# EAGLE design Altimeter (EAGLE 8.4.0)
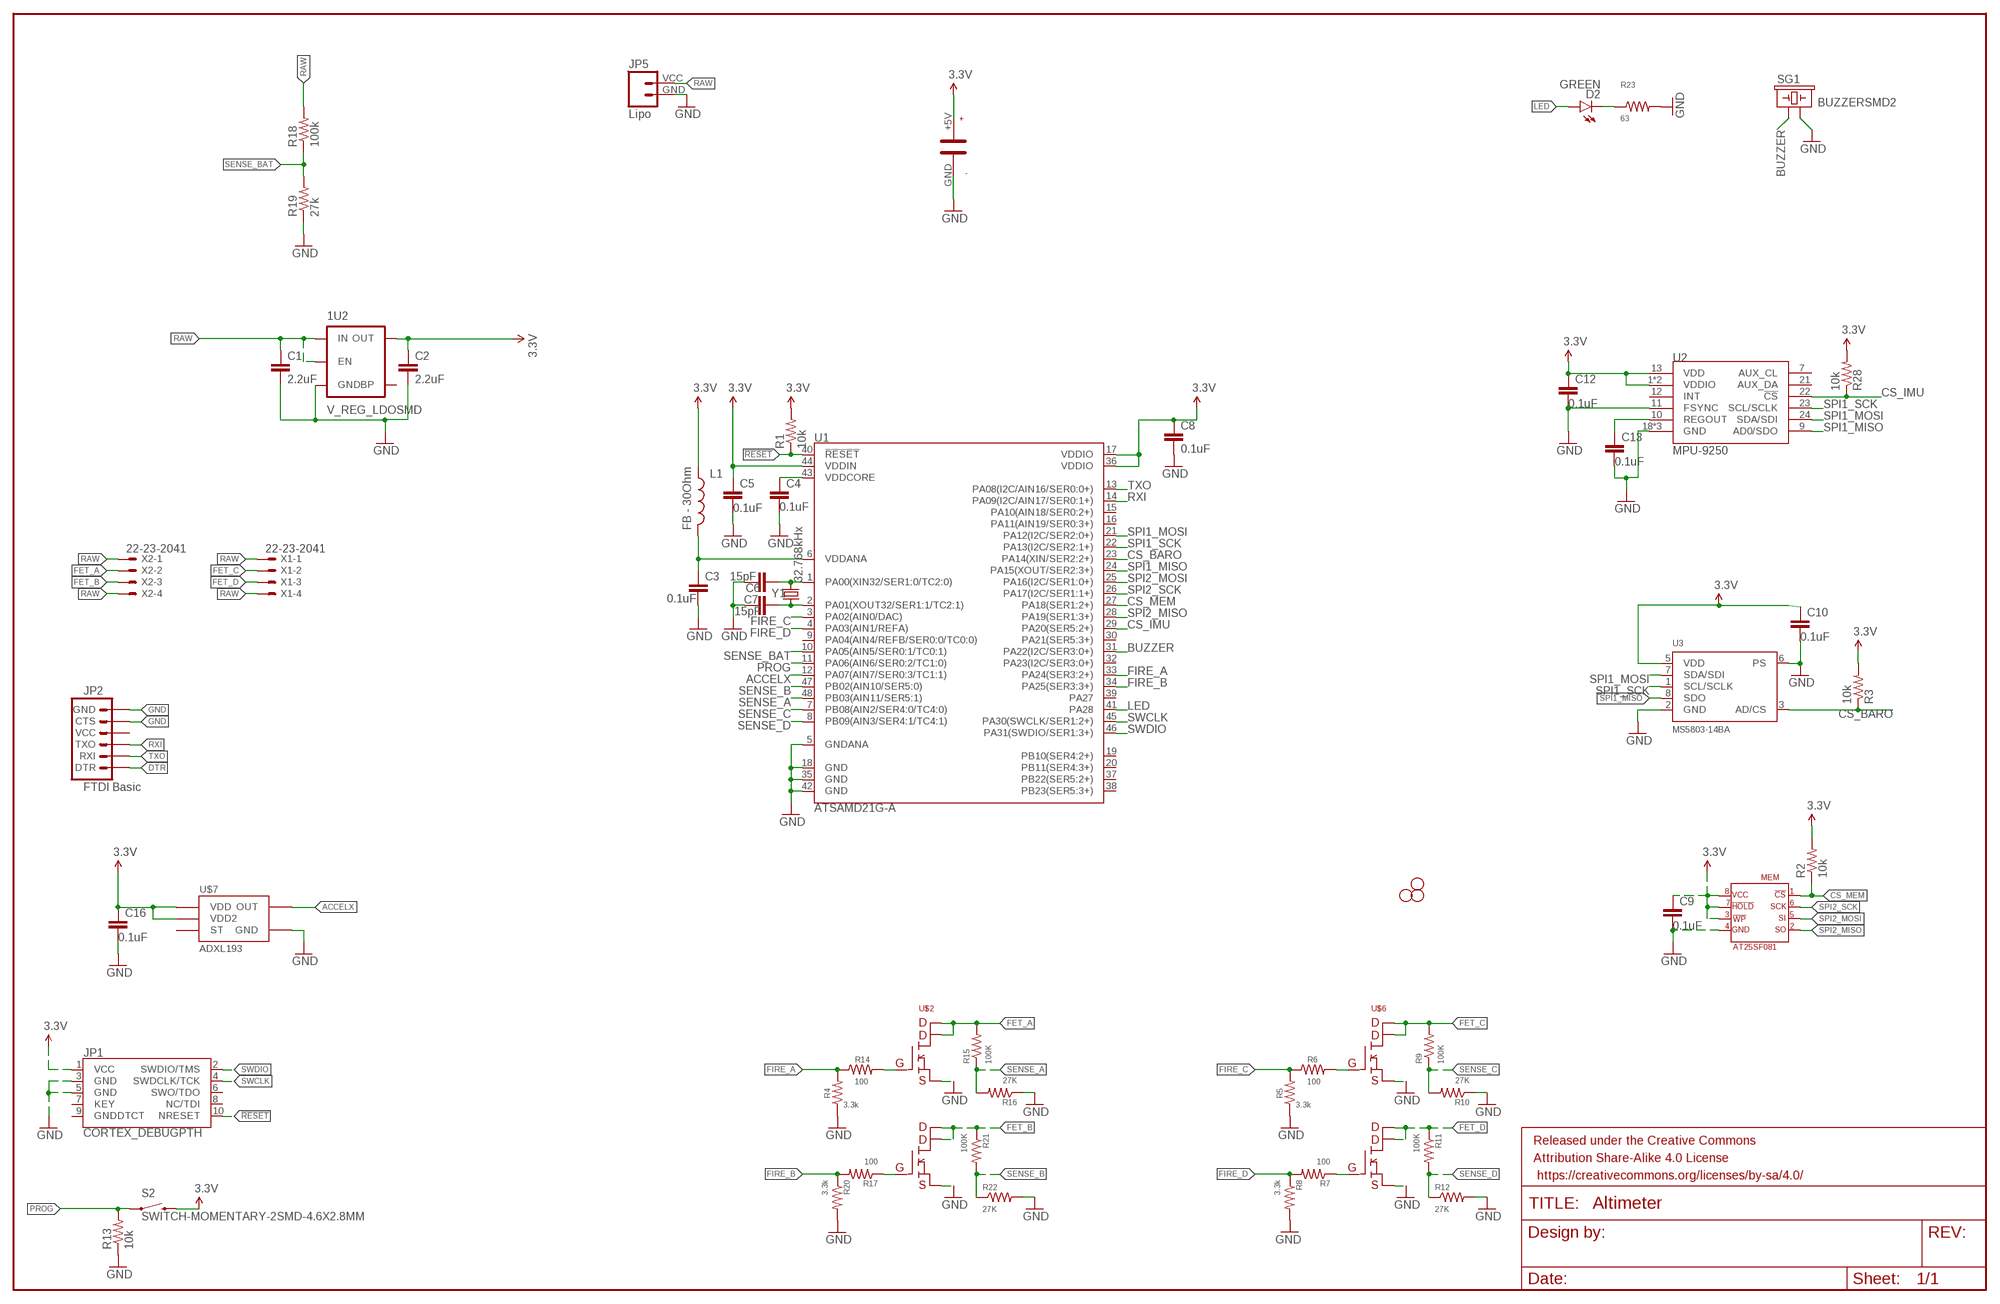
[diagram p0: schematic, sheet 1]

## Parts
1U2  V_REG_LDOSMD  [SOT23-5]
C1  2.2uF  CAP0603-CAP  [0603-CAP]
C2  2.2uF  CAP0603-CAP  [0603-CAP]
C3  0.1uF  CAP0402-CAP  [0402-CAP]
C4  0.1uF  CAP0402-CAP  [0402-CAP]
C5  0.1uF  CAP0402-CAP  [0402-CAP]
C6  15pF  CAP0402-CAP  [0402-CAP]
C7  15pF  CAP0402-CAP  [0402-CAP]
C8  0.1uF  CAP0402-CAP  [0402-CAP]
C9  0.1uF  CAP0402-CAP  [0402-CAP]
C10  0.1uF  CAP0402-CAP  [0402-CAP]
C12  0.1uF  CAP0402-CAP  [0402-CAP]
C13  0.1uF  CAP0402-CAP  [0402-CAP]
C16  0.1uF  CAP0402-CAP  [0402-CAP]
D2  GREEN  LED-GREEN1206  [LED-1206]
FRAME1  FRAME-LEDGER  [CREATIVE_COMMONS]
JP1  CORTEX_DEBUGPTH  [2X5-PTH-1.27MM]
JP2  FTDI Basic  ARDUINO_SERIAL_PROGRAMPTH  [1X06]
JP5  Lipo  M024UCON-15767  [JST-2-SMD-VERT]
L1  FB - 30Ohm  INDUCTOR0603  [0603]
MEM  AT25SF081  [AT25SF081]
R1  10k  RESISTOR0402-RES  [0402-RES]
R2  10k  RESISTOR0402-RES  [0402-RES]
R3  10k  RESISTOR0402-RES  [0402-RES]
R4  3.3k  RESISTOR0402  [0402-RES]
R5  3.3k  RESISTOR0402  [0402-RES]
R6  100  RESISTOR0402  [0402-RES]
R7  100  RESISTOR0402  [0402-RES]
R8  3.3k  RESISTOR0402  [0402-RES]
R9  100K  RESISTOR0402  [0402-RES]
R10  27K  RESISTOR0402  [0402-RES]
R11  100K  RESISTOR0402  [0402-RES]
R12  27K  RESISTOR0402  [0402-RES]
R13  10k  RESISTOR0402-RES  [0402-RES]
R14  100  RESISTOR0402  [0402-RES]
R15  100K  RESISTOR0402  [0402-RES]
R16  27K  RESISTOR0402  [0402-RES]
R17  100  RESISTOR0402  [0402-RES]
R18  100k  RESISTOR0402-RES  [0402-RES]
R19  27k  RESISTOR0402-RES  [0402-RES]
R20  3.3k  RESISTOR0402  [0402-RES]
R21  100K  RESISTOR0402  [0402-RES]
R22  27K  RESISTOR0402  [0402-RES]
R23  63  RESISTOR0402  [0402-RES]
R28  10k  RESISTOR0402-RES  [0402-RES]
S2  SWITCH-MOMENTARY-2SMD-4.6X2.8MM  [TACTILE_SWITCH_SMD_4.6X2.8MM]
SG1  BUZZERSMD2  [BUZZER-CCV]
STANDOFF2  STAND-OFF  [STAND-OFF]
STANDOFF3  STAND-OFF  [STAND-OFF]
STANDOFF4  STAND-OFF  [STAND-OFF]
U1  ATSAMD21G-A  [TQFP-48]
U2  MPU-9250  [QFN24_PAD]
U3  MS5803-14BA  [MS5803]
U$1  PB-5R0H104-R  [PB-5R0H104-R]
U$2  SI7232DN  [SI7232DN]
U$6  SI7232DN  [SI7232DN]
U$7  ADXL193  [ADXL193]
X1  22-23-2041  [22-23-2041]
X2  22-23-2041  [22-23-2041]
Y1  32.768kHx  CRYSTAL3.2X1.5MM  [CRYSTAL-SMD-3.2X1.5MM]

## Nets
3.3V: 1U2.5(OUT) C2.1 C5.1 C8.1 C9.1 C10.1 C12.1 C16.1 JP1.1(VCC) L1.1 MEM.!HOLD MEM.!WP MEM.VCC R1.2 R2.2 R3.2 R28.2 S2.3 S2.4 U1.17(VDDIO) U1.36(VDDIO) U1.44(VDDIN) U2.1(VDDIO) U2.8(VDDIO) U2.13(VDD) U3.5(VDD) U$1.+5V U$7.P$7(VDD) U$7.P$8(VDD2)
!RESET: JP1.10(NRESET) R1.1 U1.40(!RESET!)
ACCELX: U1.12(PA07(AIN7/SER0:3/TC1:1)) U$7.P$6(OUT)
BUZZER: SG1.+ U1.31(PA22(I2C/SER3:0+))
CS_BARO: R3.1 U1.23(PA14(XIN/SER2:2+)) U3.3(AD/CS)
CS_IMU: R28.1 U1.29(PA20(SER5:2+)) U2.22(!CS)
CS_MEM: MEM.!CS R2.1 U1.27(PA18(SER1:2+))
DTR: JP2.1(DTR)
FET_A: R15.2 U$2.7(PIN7) U$2.8(PIN8) X2.2
FET_B: R21.1 U$2.5(PIN5) U$2.6(PIN6) X2.3
FET_C: R9.2 U$6.7(PIN7) U$6.8(PIN8) X1.2
FET_D: R11.1 U$6.5(PIN5) U$6.6(PIN6) X1.3
FIRE_A: R4.2 R14.1 U1.33(PA24(SER3:2+))
FIRE_B: R17.2 R20.1 U1.34(PA25(SER3:3+))
FIRE_C: R5.2 R6.1 U1.3(PA02(AIN0/DAC))
FIRE_D: R7.2 R8.1 U1.4(PA03(AIN1/REFA))
GND: 1U2.2(GND) C1.2 C2.2 C3.2 C4.2 C5.2 C6.2 C7.2 C8.2 C9.2 C10.2 C12.2 C13.2 C16.2 JP1.3(GND) JP1.5(GND) JP2.5(CTS) JP2.6(GND) JP5.GND MEM.GND R4.1 R5.1 R8.2 R10.1 R12.2 R13.1 R16.1 R19.1 R20.2 R22.2 R23.2 SG1.- U1.5(GNDANA) U1.18(GND) U1.35(GND) U1.42(GND) U2.11(FSYNC) U2.18(GND) U2.20(GND) U2.CENTER(GND) U3.2(GND) U3.6(PS) U$1.GND U$2.1(PIN1) U$2.3(PIN3) U$6.1(PIN1) U$6.3(PIN3) U$7.P$3(GND)
LED: D2.A U1.41(PA28)
N$1: R6.2 U$6.2(PIN2)
N$3: C6.1 U1.1(PA00(XIN32/SER1:0/TC2:0)) Y1.P$2
N$4: C7.1 U1.2(PA01(XOUT32/SER1:1/TC2:1)) Y1.P$1
N$5: C3.1 L1.2 U1.6(VDDANA)
N$6: C4.1 U1.43(VDDCORE)
N$8: R7.1 U$6.4(PIN4)
N$12: R14.2 U$2.2(PIN2)
N$13: R17.1 U$2.4(PIN4)
N$29: D2.C R23.1
PROG: R13.2 S2.1 S2.2 U1.11(PA06(AIN6/SER0:2/TC1:0))
RAW: 1U2.1(IN) 1U2.3(EN) C1.1 JP5.VCC R18.2 X1.1 X1.4 X2.1 X2.4
REGOUT: C13.1 U2.10(REGOUT)
RXI: JP2.3(TXO) U1.14(PA09(I2C/AIN17/SER0:1+))
SENSE_A: R15.1 R16.2 U1.48(PB03(AIN11/SER5:1))
SENSE_B: R21.2 R22.1 U1.47(PB02(AIN10/SER5:0))
SENSE_BAT: R18.1 R19.2 U1.10(PA05(AIN5/SER0:1/TC0:1))
SENSE_C: R9.1 R10.2 U1.7(PB08(AIN2/SER4:0/TC4:0))
SENSE_D: R11.2 R12.1 U1.8(PB09(AIN3/SER4:1/TC4:1))
SPI1_MISO: U1.24(PA15(XOUT/SER2:3+)) U2.9(AD0/SDO) U3.8(SDO)
SPI1_MOSI: U1.21(PA12(I2C/SER2:0+)) U2.24(SDA/SDI) U3.7(SDA/SDI)
SPI1_SCK: U1.22(PA13(I2C/SER2:1+)) U2.23(SCL/SCLK) U3.1(SCL/SCLK)
SPI2_MISO: MEM.SO U1.28(PA19(SER1:3+))
SPI2_MOSI: MEM.SI U1.25(PA16(I2C/SER1:0+))
SPI2_SCK: MEM.SCK U1.26(PA17(I2C/SER1:1+))
SWCLK: JP1.4(SWDCLK/TCK) U1.45(PA30(SWCLK/SER1:2+))
SWDIO: JP1.2(SWDIO/TMS) U1.46(PA31(SWDIO/SER1:3+))
TXO: JP2.2(RXI) U1.13(PA08(I2C/AIN16/SER0:0+))
Unconnected: 1U2.4(BP) JP1.6(SWO/TDO) JP1.7(KEY) JP1.8(NC/TDI) JP1.9(GNDDTCT) JP2.4(VCC) U1.9(PA04(AIN4/REFB/SER0:0/TC0:0)) U1.15(PA10(AIN18/SER0:2+)) U1.16(PA11(AIN19/SER0:3+)) U1.19(PB10(SER4:2+)) U1.20(PB11(SER4:3+)) U1.30(PA21(SER5:3+)) U1.32(PA23(I2C/SER3:0+)) U1.37(PB22(SER5:2+)) U1.38(PB23(SER5:3+)) U1.39(PA27) U2.7(AUX_CL) U2.12(INT) U2.21(AUX_DA) U$7.P$4(ST)

## Library data of the parts
1U2 = SparkFun-PowerIC:V_REG_LDO: Voltage Regulator LDO Standard 150mA LDO voltage regulator in SOT-23 layout. Micrel part MIC5205. BP (by-pass) pin is used to lower output noise with 470pF cap.
C1 C2 = SparkFun-Capacitors:CAP: Capacitor Standard 0603 ceramic capacitor, and 0.1" leaded capacitor.
C3-C10 C12 C13 C16 = SparkFun-Passives:CAP: Capacitor Standard 0603 ceramic capacitor, and 0.1" leaded capacitor.
D2 = SparkFun-LED:LED-GREEN: Various green LEDs Green LEDs used in SFE Production 0603- DIO-00821 LARGE- DIO-00862 LILYPAD- DIO-09910; PROD_ID: DIO-00862
FRAME1 = SparkFun-Aesthetics:FRAME-LEDGER: Schematic Frame Standard 11x14 US Ledger frame
JP1 = SparkFun-Connectors:CORTEX_DEBUG: Cortex Debug Connector Datasheet <http://infocenter.arm.com/help/topic/com.arm.doc.faqs/attached/13634/cortex_debug_connectors.pdf>
JP2 = SparkFun:ARDUINO_SERIAL_PROGRAM
JP5 = SparkFun-Connectors:M02: Standard 2-pin 0.1" header. Use with - straight break away headers ( PRT-00116) - right angle break away headers (PRT-00553) - swiss pins (PRT-00743) - machine pins (PRT-00117) - female headers (PRT-00115) Molex polarized connector foot print use with: PRT-08233 with associated crimp pins and housings. 2.54_SCREWTERM for use with PRT-10571. 3.5mm Screw Terminal footprints for PRT-08084 5mm Screw Terminal footprints for use with PRT-08432
L1 = SparkFun-Passives:INDUCTOR: Inductors Basic Inductor/Choke - 0603 and 1206. Footprints are not proven and vary greatly between part numbers. INDUCTOR POWER 3.3UH 4.0A SMD 0.197" L x 0.197" W x 0.177" H (5.00mm x 5.00mm x 4.50mm)
MEM = SaL-lib:AT25SF081: AT25SF081 - 8M memory smd
R1-R3 R13 R18 R19 R28 = SparkFun-Passives:RESISTOR: Resistor Basic schematic elements and footprints for 0603, 1206, and PTH resistors.
R4-R12 R14-R17 R20-R23 = SparkFun-Resistors:RESISTOR: Resistor Basic schematic elements and footprints for 0603, 1206, and PTH resistors.
S2 = SparkFun-Electromechanical:SWITCH-MOMENTARY-2: Various NO switches- pushbuttons, reed, etc; PROD_ID: SWCH-13065
SG1 = SparkFun-Electromechanical:BUZZER: Buzzer 12mm Spark Fun Electronics SKU : Comp-Buzzer
STANDOFF2-STANDOFF4 = SparkFun-Electromechanical:STAND-OFF: #4 Stand Off This is the mechanical footprint for a #4 phillips button head screw. Use the keepout ring to avoid running the screw head into surrounding components. SKU : PRT-00447
U1 = SparkFun-DigitalIC:ATSAMD21G: Atmel SAMD21G SMART ARM-Based Microcontroller The Atmel ® | SMART ™ SAM D21 is a series of low-power microcontrollers using the 32-bit ARM ® Cortex ® -M0+ processor, and ranging from 32- to 64-pins with up to 256KB Flash and 32KB of SRAM. The SAM D21 devices operate at a maximum frequency of 48MHz and reach 2.46 CoreMark/MHz. They are designed for simple and intuitive migration with identical peripheral modules, hex compatible code, identical linear address map and pin compatible migration paths between all devices in the product series. All devices include intelligent and flexible peripherals, Atmel Event System for inter-peripheral signaling, and support for capacitive touch button, slider and wheel user interfaces.; PROD_ID: IC-13064
U2 = Testing:MPU-9250: NC pin 19. 2-6 & 14-17 not internally connected. May be used for PCB trace routing.; PROD_ID: IC-13192
U3 = MS5803:MS5803-14BA; PROD_ID: IC-12111
U$1 = SaL-lib1:PB-5R0H104-R
U$2 U$6 = SaL-lib:SI7232DN: SI7232DN dual
U$7 = SparkFun-Sensors:ADXL193: 250g accelerometer analog out
X1 X2 = con-molex:22-23-2041: .100" (2.54mm) Center Header - 4 Pin; MF: MOLEX; MPN: 22-23-2041; OC_FARNELL: 1462920; OC_NEWARK: 38C0355
Y1 = SparkFun-FreqCtrl:CRYSTAL: Various standard crystals. Proven footprints.

## Net classes
1 vcc: width 0.254 mm

## Board
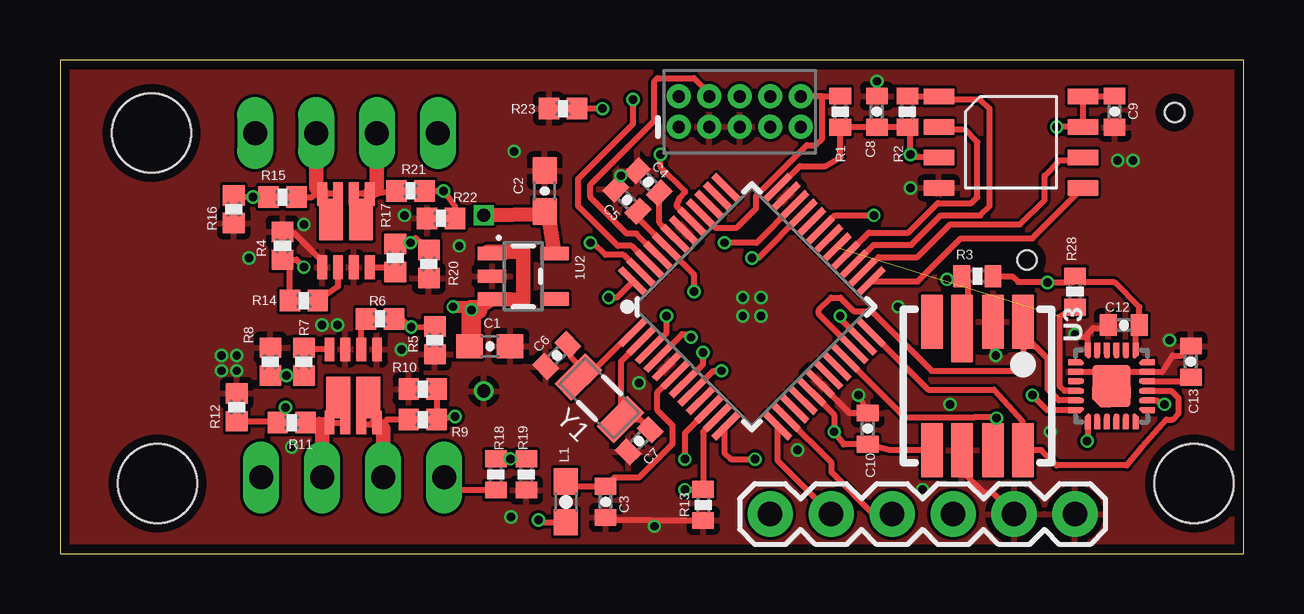
[diagram p1: board, top side]
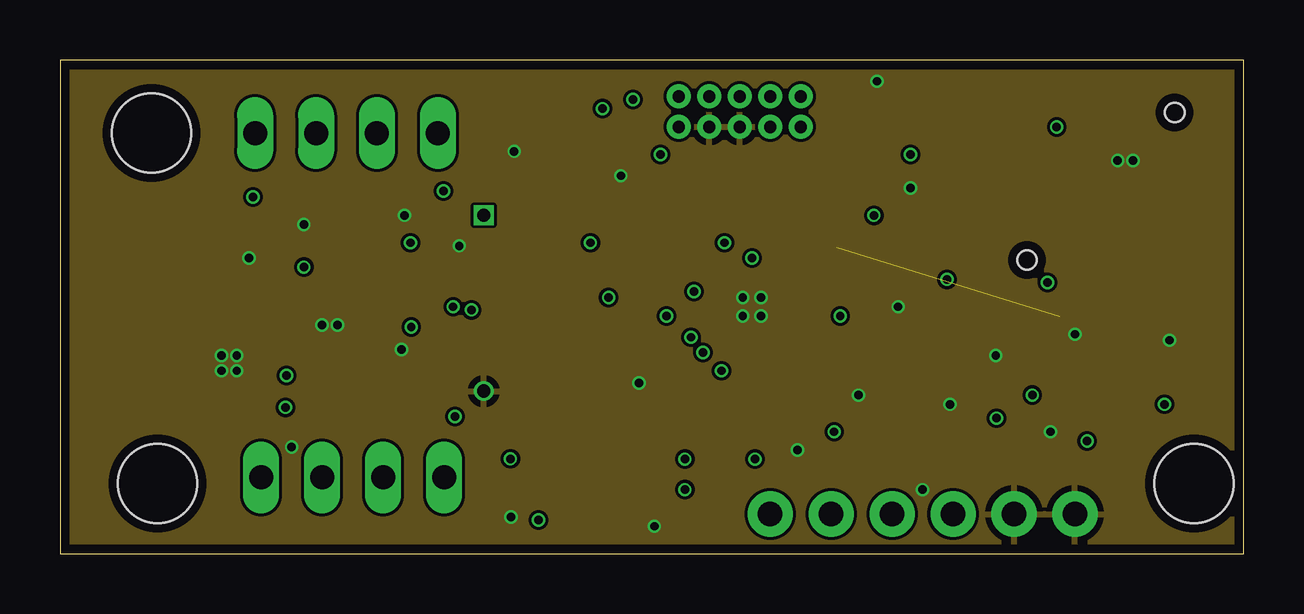
[diagram p2: board, inner layer Route2]
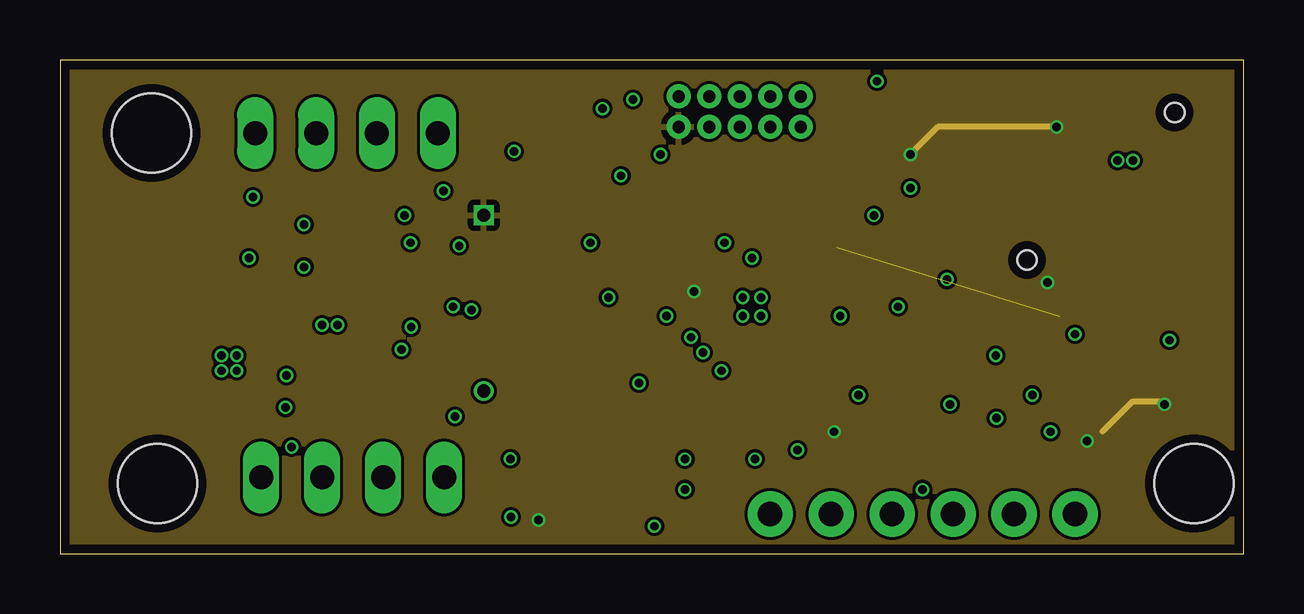
[diagram p3: board, inner layer Route15]
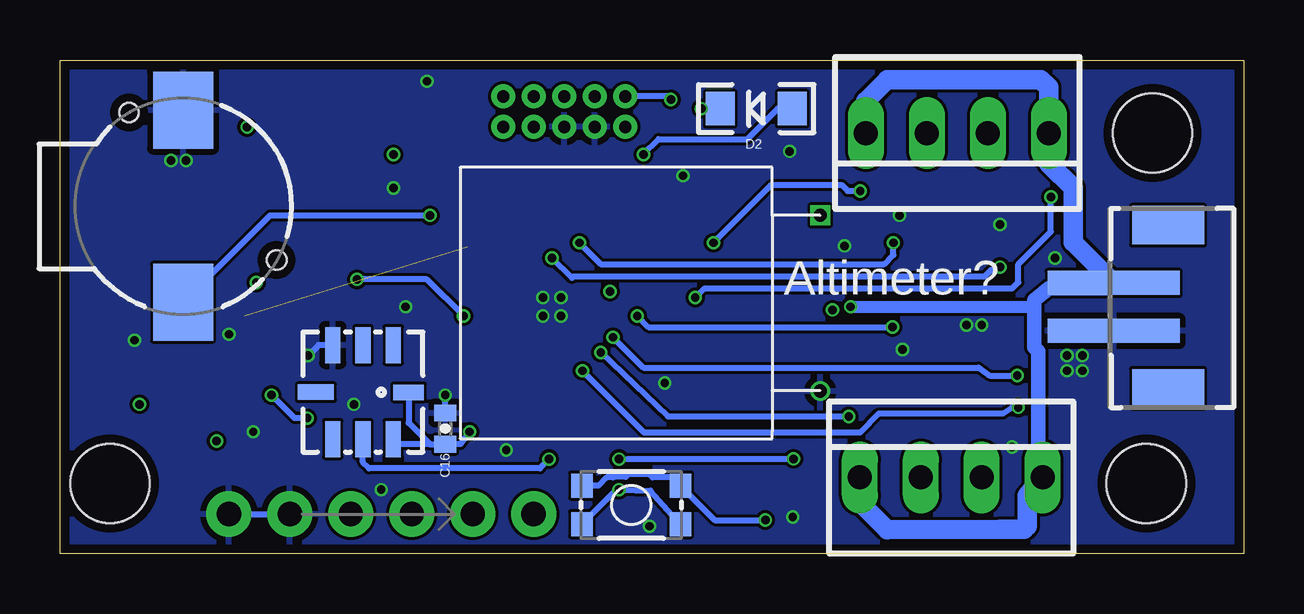
[diagram p4: board, bottom side, seen from below]

Size 49.33 x 20.56 mm. Coordinates in mm from the lower left corner, seen from the top.
Outline: 0,0 49.33,0 49.33,20.56 0,20.56 0,0
Copper layers (1*2*15*16): Top 0.035559375mm / dielectric 0.17018125mm / Route2 0.01778125mm / dielectric 47mil / Route15 0.01778125mm / dielectric 0.17018125mm / Bottom 0.035559375mm
Design rules "oshpark-4layer-tented": minimum track width 5mil, minimum drill 10mil, track to track 5mil, track to pad 5mil, pad to pad 5mil, via to via 5mil, smd to smd 5mil, copper to edge 15mil, drill to drill 6mil, minimum pad ring 4mil, minimum via ring 4mil, stop-mask expansion 2.5mil, vias tented up to drill 20mil, thermal gap 10mil

### Footprints (pad centres in the part's own frame; a part is rotated, then mirrored left to right if it is on the bottom)
SOT23-5 = smd 0.55 x 1.2: 1 -0.95,-1.3; 2 0,-1.3; 3 0.95,-1.3; 4 0.95,1.3; 5 -0.95,1.3
0603-CAP = smd 1.1 x 1: 1 -0.85,0; 2 0.85,0
0402-CAP = smd 0.7 x 0.9: 1 -0.65,0; 2 0.65,0
LED-1206 = smd 1.2 x 1.4: A -1.5,0; C 1.5,0
2X5-PTH-1.27MM = drill 0.508 pad 1: 1 -2.54,-0.635; 2 -2.54,0.635; 3 -1.27,-0.635; 4 -1.27,0.635; 5 0,-0.635; 6 0,0.635; 7 1.27,-0.635; 8 1.27,0.635; 9 2.54,-0.635; 10 2.54,0.635
1X06 = drill 1.016 pad 1.88: 1 0,0; 2 2.54,0; 3 5.08,0; 4 7.62,0; 5 10.16,0; 6 12.7,0
JST-2-SMD-VERT = smd 1 x 5.5: GND 1,-2; VCC -1,-2 | smd 1.6 x 3: P$1 -3.4,0.27; P$2 3.4,0.27
0603 = smd 1.1 x 1: 1 -0.85,0; 2 0.85,0
AT25SF081 = smd 1.27 x 0.635: !CS -3,2.54; !HOLD 3,1.27; !WP -3,0; GND -3,-1.27; SCK 3,0; SI 3,-1.27; SO -3,1.27; VCC 3,2.54
0402-RES = smd 0.7 x 0.9: 1 -0.65,0; 2 0.65,0
0402-RES' = smd 0.85 x 0.9: 1 -0.58,0; 2 0.58,0
TACTILE_SWITCH_SMD_4.6X2.8MM = smd 0.9 x 1: 1 -2.05,-0.8; 2 2.05,-0.8; 3 2.05,0.8; 4 -2.05,0.8
BUZZER-CCV = smd 3.2 x 2.5: + 4,0; - -4,0 | hole 0.8: -3.9,-2.25; 2.25,3.9
STAND-OFF = hole 3.302: 0,0
TQFP-48 = smd 1.5 x 0.28: 1 -4.25,2.75; 2 -4.25,2.25; 3 -4.25,1.75; 4 -4.25,1.25; 5 -4.25,0.75; 6 -4.25,0.25; 7 -4.25,-0.25; 8 -4.25,-0.75; 9 -4.25,-1.25; 10 -4.25,-1.75; 11 -4.25,-2.25; 12 -4.25,-2.75; 25 4.25,-2.75; 26 4.25,-2.25; 27 4.25,-1.75; 28 4.25,-1.25; 29 4.25,-0.75; 30 4.25,-0.25; 31 4.25,0.25; 32 4.25,0.75; 33 4.25,1.25; 34 4.25,1.75; 35 4.25,2.25; 36 4.25,2.75 | smd 0.28 x 1.5: 13 -2.75,-4.25; 14 -2.25,-4.25; 15 -1.75,-4.25; 16 -1.25,-4.25; 17 -0.75,-4.25; 18 -0.25,-4.25; 19 0.25,-4.25; 20 0.75,-4.25; 21 1.25,-4.25; 22 1.75,-4.25; 23 2.25,-4.25; 24 2.75,-4.25; 37 2.75,4.25; 38 2.25,4.25; 39 1.75,4.25; 40 1.25,4.25; 41 0.75,4.25; 42 0.25,4.25; 43 -0.25,4.25; 44 -0.75,4.25; 45 -1.25,4.25; 46 -1.75,4.25; 47 -2.25,4.25; 48 -2.75,4.25
QFN24_PAD = smd 0.5 x 0.25: 1 -1.55,1; 2 -1.55,0.6; 3 -1.55,0.2; 4 -1.55,-0.2; 5 -1.55,-0.6; 6 -1.55,-1; 13 1.55,-1; 14 1.55,-0.6; 15 1.55,-0.2; 16 1.55,0.2; 17 1.55,0.6; 18 1.55,1 | smd 0.08 x 0.13: 1$1 -1.32,1.06; 1$3 -1.26,0.94; P$33 1.26,-0.94; P$34 1.32,-1.06; P$58 1.26,0.94; P$59 1.32,1.06; P$68 -1.26,-0.94; P$69 -1.32,-1.06 | smd 0.1 x 0.185 rotated 45: 1$2 -1.25,1.024; P$49 1.024,-1.25 | smd 0.14 x 0.14: 1$4 -1.22,0.945; P$23 -0.945,-1.22; P$24 1.22,-0.945; P$36 0.945,1.22; P$51 0.945,-1.22; P$56 1.22,0.945; P$61 -0.945,1.22; P$66 -1.22,-0.945 | smd 0.05 x 0.05: 1$5 -1.175,0.97; P$25 -0.97,-1.175; P$31 1.175,-0.97; P$37 0.97,1.175; P$52 0.97,-1.175; P$57 1.175,0.97; P$62 -0.97,1.175; P$67 -1.175,-0.97 | smd 0.25 x 0.5: 7 -1,-1.55; 8 -0.6,-1.55; 9 -0.2,-1.55; 10 0.2,-1.55; 11 0.6,-1.55; 12 1,-1.55; 19 1,1.55; 20 0.6,1.55; 21 0.2,1.55; 22 -0.2,1.55; 23 -0.6,1.55; 24 -1,1.55 | smd 0.25 x 0.25: CENTER 0,0 | smd 0.4 x 0.4: DBBADFE -0.675,0.24 | smd 0.6 x 1.2: DBBADFE1 -0.575,-0.195 | smd 0.25 x 0.3: P$1 -0.2,1.3; P$3 0.2,1.3; P$5 0.6,1.3; P$11 -0.6,1.3; P$16 0.2,-1.3; P$18 -0.2,-1.3; P$20 -0.6,-1.3; P$26 0.6,-1.3 | smd 0.3 x 0.25: P$2 -1.3,0.2; P$4 -1.3,0.6; P$28 -1.3,-0.2; P$38 -1.3,-0.6; P$40 1.3,0.2; P$42 1.3,-0.2; P$44 1.3,-0.6; P$50 1.3,0.6 | smd 0.1 x 0.185 rotated 225: P$7 1.25,-1.024; P$60 -1.024,1.25 | smd 1.1 x 1.59: P$13 0.325,0 | smd 0.3 x 0.5 rotated 315: P$14 -0.592,0.512 | smd 0.5 x 1.59: P$15 -0.27,0 | smd 0.1 x 0.185 rotated 135: P$22 -1.024,-1.25; P$55 1.25,1.024 | smd 0.13 x 0.08: P$27 -0.94,-1.26; P$29 -1.06,-1.32; P$39 0.94,1.26; P$41 1.06,1.32; P$53 0.94,-1.26; P$54 1.06,-1.32; P$63 -0.94,1.26; P$64 -1.06,1.32 | smd 0.1 x 0.185 rotated 315: P$35 1.024,1.25; P$65 -1.25,-1.024
MS5803 = smd 2.25 x 0.9: 1 -2.675,1.9; 2 -2.675,0.65; 4 -2.675,-1.9; 5 2.675,-1.9; 6 2.675,-0.65; 7 2.675,0.65; 8 2.675,1.9 | smd 2.8 x 0.9: 3 -2.4,-0.65
PB-5R0H104-R = drill 0.55 square: +5V 0,0 | drill 0.55: GND 0,7.32
SI7232DN = smd 0.991 x 0.406: 1 0,0; 2 0,-0.66; 3 0,-1.321; 4 0,-1.981; 5 3.048,-1.981; 6 3.048,-1.321; 7 3.048,-0.66; 8 3.048,0 | smd 1.727 x 0.991: P$9 1.994,-0.368; P$10 1.994,-1.615
ADXL193 = smd 1.5 x 0.64: P$1 -1.96,1.26; P$2 -1.96,0; P$3 -1.96,-1.26; P$5 1.96,-1.26; P$6 1.96,0; P$7 1.96,1.26 | smd 0.64 x 1.5: P$4 0,-1.96 | smd 0.64 x 1.27: P$8 0.01,1.9
22-23-2041 = drill 1 long: 1 -3.81,0; 2 -1.27,0; 3 1.27,0; 4 3.81,0
CRYSTAL-SMD-3.2X1.5MM = smd 1 x 1.8: P$1 -1.25,0; P$2 1.25,0

### Placement (x,y rotation side)
1U2  19.3,11.56 270 top
C1  17.91,8.64 0 top
C2  20.19,15.11 90 top
C3  22.73,2.16 270 top
C4  24.51,15.49 135 top
C5  23.62,14.73 135 top
C6  20.7,8.25 225 top
C7  24.13,4.7 225 top
C8  34.04,18.41 90 top
C9  43.94,18.41 270 top
C10  33.66,5.21 90 top
C12  44.32,9.53 180 top
C13  47.12,8 90 top
C16  33.27,5.21 90 bottom
D2  20.32,18.54 180 bottom
FRAME1  -82.93,20.45 0 top  (outside the outline)
JP1  28.32,18.41 0 top
JP2  29.59,1.65 0 top
JP5  3.43,10.29 270 bottom
L1  21.08,2.16 90 top
MEM  39.62,16.51 0 top
R1  32.51,18.41 270 top
R2  35.31,18.41 270 top
R3  38.23,11.56 0 top
R4  3.3k  [0402-RES']  9.27,12.83 270 top
R5  3.3k  [0402-RES']  15.62,8.89 90 top
R6  100  [0402-RES']  13.34,9.78 180 top
R7  100  [0402-RES']  10.16,8 270 top
R8  3.3k  [0402-RES']  8.76,8 90 top
R9  100K  [0402-RES']  15.11,5.59 180 top
R10  27K  [0402-RES']  15.11,6.86 0 top
R11  100K  [0402-RES']  9.65,5.46 180 top
R12  27K  [0402-RES']  7.37,6.1 90 top
R13  26.8,2.03 90 top
R14  100  [0402-RES']  10.16,10.54 0 top
R15  100K  [0402-RES']  9.27,14.86 0 top
R16  27K  [0402-RES']  7.24,14.35 90 top
R17  100  [0402-RES']  13.97,12.32 90 top
R18  18.16,3.3 270 top
R19  19.43,3.3 90 top
R20  3.3k  [0402-RES']  15.37,12.06 270 top
R21  100K  [0402-RES']  14.61,15.11 0 top
R22  27K  [0402-RES']  15.88,13.97 180 top
R23  63  [0402-RES']  20.96,18.54 180 top
R28  42.29,10.92 90 top
S2  25.53,2.03 0 bottom
SG1  44.2,14.48 270 bottom
STANDOFF2  3.81,17.53 0 top
STANDOFF3  47.24,2.92 0 top
STANDOFF4  4.06,2.92 0 top
U1  28.83,10.29 45 top
U2  43.81,6.98 90 top
U3  38.23,6.98 270 top
U$1  17.65,14.1 180 bottom
U$2  10.92,11.94 90 top
U$6  13.21,8.51 270 top
U$7  36.7,6.73 270 bottom
X1  12.19,3.18 0 bottom
X2  11.94,17.53 180 bottom
Y1  22.48,6.48 135 top

### Tracks (layer width: path | path; a pad name or v marks a point on that pad's centre or on a via)
3.3V  (via drill 0.35)
  Top 0.254: U1.36 30.06,15.41 30.21,15.53 30.82,16.15 31.9,16.15 32.51,16.51 R1.2 C8.1 R2.2 35.43,17.64 v35.43,16.64 35.56,16.51 MEM.!WP | C5.1 23.92,14.27 23.75,14.1 23.96,14.1 U1.44 26.42,11.64 v26.42,10.92 | C9.1 43.93,19.05 MEM.VCC MEM.!HOLD v41.53,17.78 | R3.2 39.68,11.56 39.92,11.32 41.13,11.32 v41.15,11.3 42.18,11.3 R28.2 42.69,11.3 43.94,11.3 44.97,10.27 C12.1 44.81,9.37 U2.13 | v46.02,6.22 45.86,6.22 45.7,6.38 U2.8 | U3.5 34.57,4.31 C10.1 32.65,4.56 v32.26,5.08 32.26,5.8 U1.17 | v19.94,1.4 20.03,1.31 L1.1 | U2.1 42.81,4.71 v42.8,4.7
  Top 0.61: U$1.+5V 20.11,14.14 C2.1 20.35,14.17 1U2.5
  Route15 0.254: v41.53,17.78 36.58,17.78 v35.43,16.64 | 43.43,5.08 44.7,6.35 45.89,6.35 v46.02,6.22
  Bottom 0.254: 33.91,4.56 C16.1 33.26,4.57 32.64,4.57 v32.26,5.08 | 33.91,4.56 35.23,4.56 U$7.P$7 | U$7.P$8 34.8,5.45 33.91,4.56 | v19.94,1.4 22.04,1.4 S2.3 23.82,3.18 24.64,3.18 24.77,3.3 25.65,3.3 25.76,3.2 26.25,3.2 26.28,3.18 26.54,3.18 26.89,2.83 S2.4
  pour Route15: -0.38,-1.14 50.42,-1.14 50.42,26.8 -0.38,26.8
!RESET
  Top 0.254: JP1.10 30.88,19.07 31.75,19.07 | 31.75,19.07 R1.1 | U1.40 27.3,13.59 28.19,13.59 29.01,14.4 29.01,14.91 30.22,16.12 30.37,16.27 30.38,16.31 30.43,16.33 31.12,17.02 31.5,17.02 31.75,17.28 31.75,19.07
ACCELX  (via drill 0.35)
  Top 0.254: U1.12 27.69,5.26 27.69,4.19 27.94,3.94 v28.96,3.94
  Bottom 0.254: v28.96,3.94 29.34,3.56 36.45,3.56 36.7,3.81 U$7.P$6
BUZZER  (via drill 0.35)
  Top 0.254: U1.31 32.29,14.1 v33.91,14.1
  Bottom 0.254: SG1.+ 40.58,14.1 v33.91,14.1
CS_BARO  (via drill 0.35)
  Top 0.254: U3.3 37.83,9.89 37.83,11.43 | 37.83,11.43 R3.1 | U1.23 32.51,9.79 v32.51,9.91 | v36.96,11.43 37.83,11.43
  Bottom 0.254: v32.51,9.91 34.04,11.43 v36.96,11.43
CS_IMU  (1 unrouted)
  Top 0.254: U2.22 41.86,6.79 41.66,6.98 41.66,9.89 R28.1
CS_MEM
  Top 0.254: U1.27 33.09,12.05 33.91,12.87 35.47,12.87 36.7,14.1 38.35,14.1 38.73,14.48 38.73,18.54 38.35,18.92 36.75,18.92 MEM.!CS 35.32,19.05 R2.1
FET_A
  Top 0.254: R15.2 10.5,14.86 10.69,15.05 10.92,15.05 U$2.8 U$2.7
  Top 0.61: U$2.8 10.67,15.24 X2.2
FET_B
  Top 0.254: R21.1 13.2,14.99 13.14,15.05 12.9,15.05 U$2.5 U$2.6
  Top 0.61: U$2.5 13.21,15.29 X2.3
FET_C
  Top 0.254: R9.2 13.63,5.59 13.44,5.4 | 13.44,5.4 12.61,5.4 U$6.7 | 13.46,5.21 13.44,5.23 13.44,5.4
  Top 0.61: U$6.8 13.46,5.21 X1.2
FET_D
  Top 0.254: R11.1 10.8,5.59 10.99,5.4 11.23,5.4 11.29,5.46 | 11.29,5.46 U$6.6 | U$6.5 11.29,5.46
  Top 0.61: 10.99,5.4 10.92,5.33 X1.3
FIRE_A  (via drill 0.35)
  Top 0.254: U1.33 29.09,12.32 v28.83,12.32 | v10.16,11.94 9.85,12.25 9.53,12.25 | 9.53,12.25 R4.2 | R14.1 9.58,12.19 9.53,12.25
  Bottom 0.254: v28.83,12.32 28,11.49 27.94,11.56 10.79,11.56 10.54,11.81 10.16,11.81 v10.16,11.94
FIRE_B  (via drill 0.35)
  Top 0.254: U1.34 29.02,12.95 v27.69,12.95 | R20.1 14.8,13.15 v14.61,12.95 14.17,12.95 R17.2
  Bottom 0.254: v27.69,12.95 26.8,12.06 14.99,12.06 14.61,12.45 v14.61,12.95
FIRE_C  (via drill 0.35)
  Top 0.254: R6.1 14.04,9.91 v14.63,9.44 R5.2 | U1.3 25.27,9.21 v25.27,9.91
  Bottom 0.254: v25.27,9.91 24.81,9.44 v14.63,9.44
FIRE_D  (via drill 0.35)
  Top 0.254: R7.2 v9.44,7.42 R8.1 | U1.4 25.92,9.14 26.16,9.14 v26.29,9.02
  Bottom 0.254: v26.29,9.02 25.02,7.75 11.05,7.75 10.6,7.42 v9.44,7.42
GND  (via drill 0.35)
  Top 0.254: U$2.1 10.92,12.19 9.78,13.33 9.34,13.33 R4.1 | U2.20 43.22,7.58 43.75,7.05 | 43.75,7.05 U2.CENTER | U2.18 42.81,9.02 | 42.81,9.02 42.81,9.16 43.05,9.4 43.55,9.4 C12.2 | 43.75,7.05 44.29,7.58 U2.11 45.94,7.58 46.36,8.25 46.72,8.25 C13.2 | 42.81,9.02 42.42,9.02 v42.29,9.14 | U3.2 38.88,8.37 v38.99,8.25 | U3.6 37.58,3.44 38.48,2.54 38.86,2.54 JP2.5 | U1.18 32.91,5.86 C10.2 v33.27,6.6 | C3.2 22.86,1.38 24.64,1.38 | 24.64,1.38 R13.1 | v24.77,1.14 24.64,1.27 24.64,1.38 | C5.2 23.16,15.54 v23.37,15.75
  Bottom 0.254: U$7.P$3 38.55,8.69 v38.99,8.25 | JP2.6 JP2.5 | C16.2 v33.27,6.6
  other vias: 6.73,8.25 7.37,8.25 7.37,7.62 6.73,7.62 18.8,1.52 14.22,8.51 16.64,12.83 14.35,14.1 11.56,9.53 10.92,9.53 10.16,13.72 18.92,16.76 28.45,10.67 29.21,10.67 29.21,9.91 28.45,9.91 24.13,7.11 46.23,8.89 44.7,16.38 44.07,16.38 35.43,15.24 34.04,19.68 9.65,4.45 7.87,12.32 34.92,10.29 37.08,6.22 30.73,4.32 35.94,2.67 41.27,5.08
  pour Top: -0.38,-1.14 50.42,-1.14 50.42,22.99 -0.38,22.99
  pour Bottom: -0.38,-1.14 50.42,-1.14 50.42,24.26 -0.38,24.26
  pour Route2: -0.38,-1.14 50.42,-1.14 50.42,25.53 -0.38,25.53
LED  (via drill 0.35)
  Top 0.254: U1.41 25.7,14.48 25.82,14.84 26.04,15.05 26.04,15.11 25.02,16.13 v25.02,16.64
  Bottom 0.254: v25.02,16.64 24.38,17.27 20.7,17.27 19.43,18.54 D2.A
N$1
  Top 0.254: U$6.2 12.55,9.83 R6.2
N$3
  Top 0.254: U1.1 23.83,9.23 22.23,7.62 21.85,7.62 | 21.85,7.62 Y1.P$2 | C6.1 21.29,8.19 21.85,7.62
N$4
  Top 0.254: U1.2 23.37,8 Y1.P$1 24.16,5.59 C7.1
N$5
  Top 0.254: L1.2 21.28,2.81 C3.1 23.1,3.18 24.13,3.18 25.53,4.57 25.53,5.33 24.89,5.97 24.89,6.73 25.62,7.46 U1.6
N$6
  Top 0.254: U1.43 24.97,13.79 C4.1
N$8
  Top 0.254: U$6.4 10.21,8.51 R7.1
N$12
  Top 0.254: U$2.2 11.58,11.13 R14.2
N$13
  Top 0.254: U$2.4 13.91,11.94 R17.1
N$29  (via drill 0.35)
  Top 0.254: v22.61,18.54 R23.1
  Bottom 0.254: D2.C v22.61,18.54
PROG  (via drill 0.35)
  Top 0.254: U1.11 26.8,5.07 R13.2 26.78,2.67 v26.04,2.67
  Bottom 0.254: S2.2 24.73,2.63 v26.04,2.67 26.14,2.67 S2.1
RAW  (via drill 0.35)
  Top 0.254: R18.2 16.4,2.65 X1.1
  Top 0.508: v16.38,10.29 17.02,10.29 v17.14,10.16
  Top 0.61: 17.4,10.16 17.4,10.26 1U2.3 18.73,10.61 19.3,10.54 19.3,12.57 17.82,12.57 1U2.1
  Top 0.813: C1.1 17.14,8.72 v17.14,10.16 17.4,10.16
  Bottom 0.508: v16.38,10.29 8.74,10.29
  Bottom 0.61: JP5.VCC 5.67,11.05 8.13,11.05 8.74,10.57 8.74,10.29 8.74,8.61 8.56,8.43 8.56,3.36 X1.4
  Bottom 0.813: JP5.VCC 7.11,12.97 7.11,15.24 8.13,16.26 X2.1 8.13,19.43 8.45,19.76 14.86,19.74 15.75,18.85 X2.4 | X1.4 8.44,3.11 9.02,2.41 9.02,1.14 9.14,1.02 10.16,1.02 | 10.16,1.02 | 10.16,1.02 14.86,1.01 16,2.15 X1.1
REGOUT
  Top 0.254: U2.10 46.95,7.19 C13.1
RXI
  Top 0.254: U1.14 32.15,3.79 32.15,3.38 33.88,1.65 JP2.3
SENSE_A  (via drill 0.35)
  Top 0.254: R16.2 7.31,14.86 v8.04,14.86 R15.1 | U1.48 23.2,10.67 v22.86,10.67 22.73,10.67
  Bottom 0.254: v22.86,10.67 22.48,11.05 9.65,11.05 9.4,11.3 9.4,12.06 8.04,13.42 v8.04,14.86
SENSE_B  (via drill 0.35)
  Top 0.254: R21.2 v15.98,15.11 16.46,14.48 R22.1 | U1.47 23.49,12.45 22.73,12.45 22.23,12.95 v22.1,12.95
  Bottom 0.254: v22.1,12.95 19.69,15.37 16.76,15.37 16.51,15.11 v15.98,15.11
SENSE_BAT  (via drill 0.35)
  Top 0.254: R18.1 v18.76,3.95 R19.2 | U1.10 26.04,5.02 v26.04,3.94
  Bottom 0.254: v26.04,3.94 25.67,3.95 v18.76,3.95
SENSE_C  (via drill 0.35)
  Top 0.254: v16.46,5.71 R9.1 R10.2 | U1.7 26.8,7.9 v26.8,8.38
  Bottom 0.254: v26.8,8.38 24,5.71 v16.46,5.71
SENSE_D  (via drill 0.35)
  Top 0.254: R12.1 9,5.52 R11.2 9.4,5.91 v9.4,6.1 | U1.8 27.22,7.62 v27.56,7.62
  Bottom 0.254: v27.56,7.62 25,5.06 15.99,5.06 15.2,5.84 10.03,5.84 9.65,6.1 v9.4,6.1
SPI1_MISO
  Top 0.254: U1.24 36.17,6.83 38.92,6.83 40.09,5.54 40.09,4.86 40.08,4.36 U3.8 | U3.8 | U2.9 46.3,6.79 46.61,6.48 46.61,5.84 46.36,5.59 46.1,5.59 45.09,4.45 44.45,3.68 41.53,3.68 40.89,4.32 U3.8
SPI1_MOSI  (via drill 0.35)
  Top 0.254: U1.21 35.2,5.69 38.13,5.69 39.02,5.69 | 39.02,5.69 38.99,5.21 38.88,5.1 U3.7 | U2.24 41.13,5.98 v40.51,6.6 | 39.02,5.69 v39.02,5.64
  Bottom 0.254: v39.02,5.64 39.55,5.64 v40.51,6.6
SPI1_SCK
  Top 0.254: 33.02,8.59 U1.22 31.62,9.97 31.62,10.16 32.13,10.67 32.51,10.67 33.07,10.11 33.82,10.11 36.31,7.61 39.77,7.61 40.16,8 40.17,9.02 40.26,9.02 | 40.26,9.02 40.13,9.15 U3.1 | U2.23 41.62,6.38 41.15,6.86 41.15,8.13 40.26,9.02
SPI2_MISO
  Top 0.254: U1.28 32.87,12.54 33.71,13.37 35.34,13.37 36.58,14.61 37.97,14.61 38.23,14.86 38.23,17.14 37.72,17.65 36.75,17.65 MEM.SO
SPI2_MOSI
  Top 0.254: MEM.SI 40.52,13.14 37.53,13.14 35.74,11.35 U1.25
SPI2_SCK
  Top 0.254: U1.26 33.45,11.7 34.11,12.36 35.73,12.36 37.08,13.72 40.01,13.72 41.02,14.73 41.02,15.75 41.66,16.38 42.5,16.38 MEM.SCK
SWCLK
  Top 0.254: U1.45 24.01,13.33 23.62,13.33 22.1,14.86 22.1,15.37 24.77,18.03 24.77,19.68 24.89,19.81 26.42,19.81 27.05,19.18 JP1.4
SWDIO  (via drill 0.35)
  Top 0.254: U1.46 23.81,12.83 23.24,12.83 21.59,14.48 21.59,15.62 23.88,17.91 v23.88,18.92
  Bottom 0.254: v23.88,18.92 24,19.05 JP1.2
TXO
  Top 0.254: U1.13 29.89,3.89 JP2.2

### Text on the board
bNames: Altimeter?